# Altium schematic sheet Inclinometer.SchDoc
size 420 x 297 mm; Address1: Address1; Address2: Address2; Address3: Address3; Address4: Address4; DocumentNumber: АБВГ.123456.001 Э3; SheetNumber: 1; Scale: 1:1; DocumentType: Схема электрическая принципиальная; FirstReferrence: АБВГ.123456.001
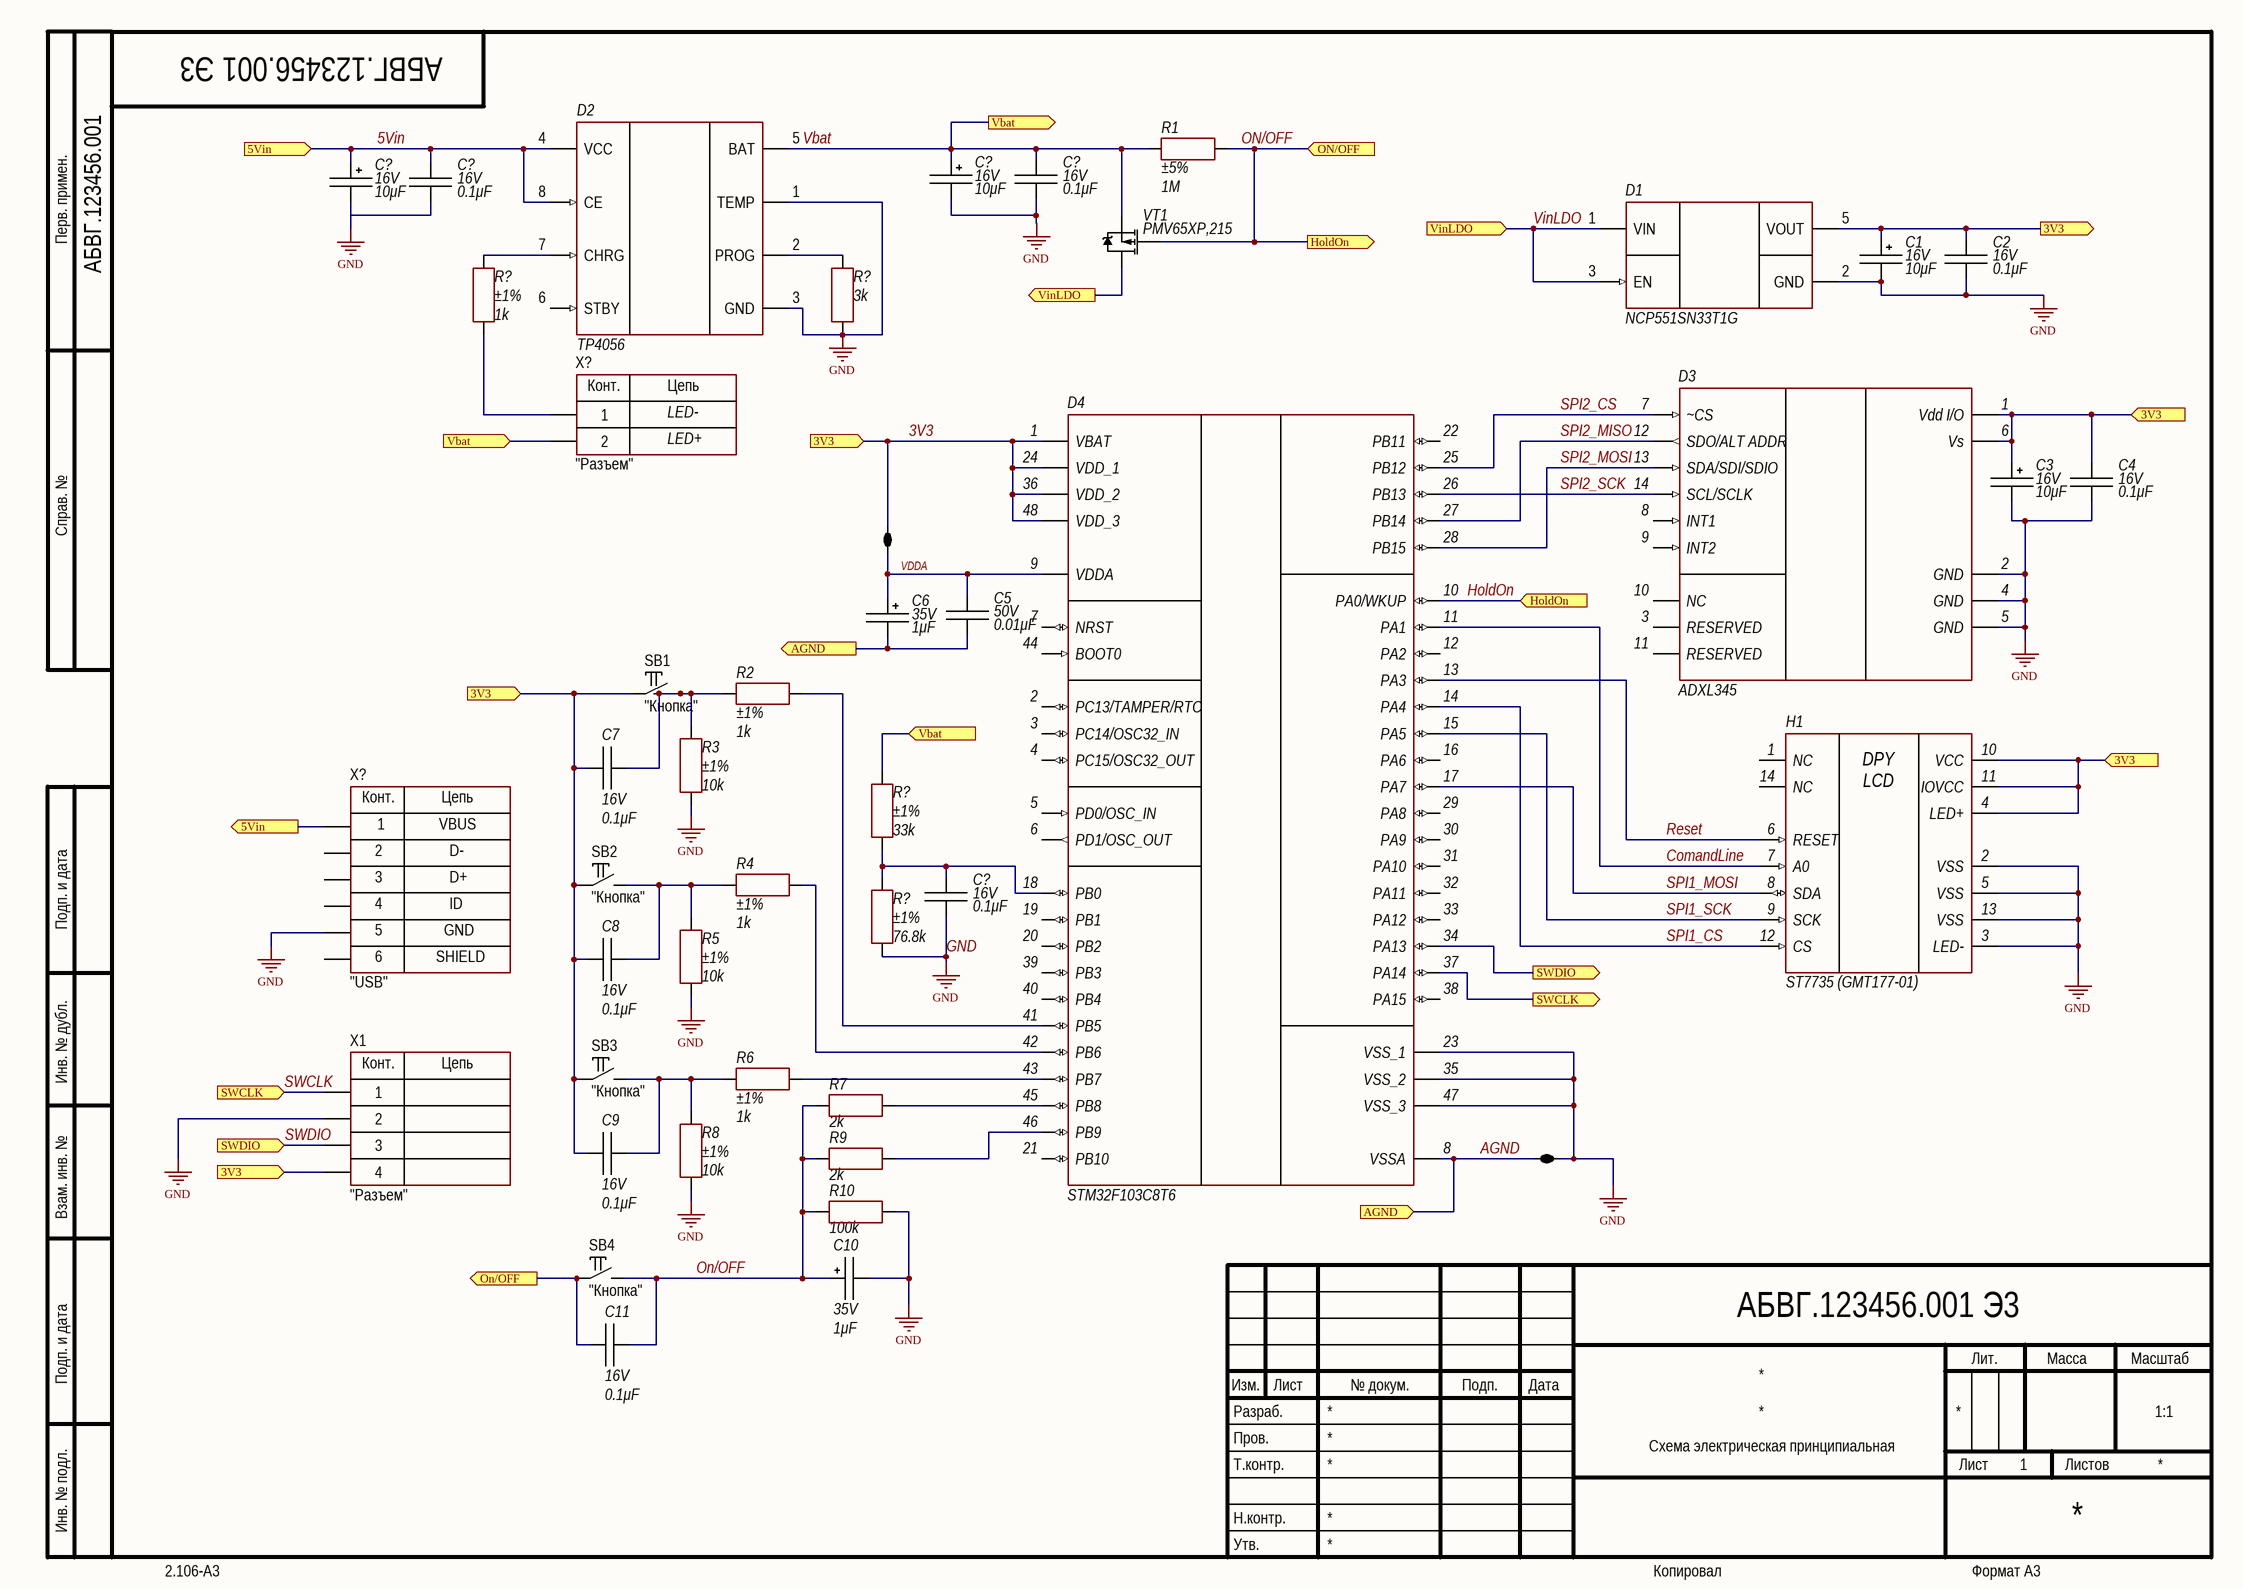
[diagram p0: Inclinometer.SchDoc]

## Parts
(Parts that share a designator on the sheet are numbered #1, #2 ... from top to bottom, then left to right.)
C1  value 10μF  Voltage: 16V  [CAP: TANTAL-A]
C2  value 0.1μF  Voltage: 16V  [CAP: 0603]
C3  value 10μF  Voltage: 16V  [CAP: 0603]  (hidden comment: Ceramic capacitor, 0.1μF, X7R, ±10%, 16V, 0603, -55...+125°C)
C4  value 0.1μF  Voltage: 16V  [CAP: 0603]
C5  value 0.01μF  Voltage: 50V  [CAP: 0603]
C6  value 1μF  Voltage: 35V  [CAP: TANTAL-A]
C7  value 0.1μF  Voltage: 16V  [CAP: 0603]
C8  value 0.1μF  Voltage: 16V  [CAP: 0603]
C9  value 0.1μF  Voltage: 16V  [CAP: 0603]
C10  value 1μF  Voltage: 35V  [CAP: TANTAL-A]
C11  value 0.1μF  Voltage: 16V  [CAP: 0603]
C?#1  value 10μF  Voltage: 16V  [CAP: TANTAL-A]
C?#2  value 0.1μF  Voltage: 16V  [CAP: 0603]
C?#3  value 10μF  Voltage: 16V  [CAP: TANTAL-A]
C?#4  value 0.1μF  Voltage: 16V  [CAP: 0603]
C?#5  value 0.1μF  Voltage: 16V  [CAP: 0603]
D1  (no value)  [5-TSOP]
D2  (no value)  [SOP8]
D3  ADXL345  [ADXL345]
D4  STM32F103C8T6  [LQFP48]
H1  ST7735 (GMT177-01)  [ST7735 DISPLAY]
J1  2 way net tie junction  [2way_MP]  (value not drawn)  (net tie, no BOM)
J2  2 way net tie junction  [2way_MP]  (value not drawn)  (net tie, no BOM)
R1  value 1M  Tolerance: ±5%  [RES: 0603]
R2  value 1k  Tolerance: ±1%  [RES: 0603]
R3  value 10k  Tolerance: ±1%  [RES: 0603]
R4  value 1k  Tolerance: ±1%  [RES: 0603]
R5  value 10k  Tolerance: ±1%  [RES: 0603]
R6  value 1k  Tolerance: ±1%  [RES: 0603]
R7  value 2k  [RES: 0603]
R8  value 10k  Tolerance: ±1%  [RES: 0603]
R9  value 2k  [RES: 0603]
R10  value 100k  [RES: 0603]
R?#1  value 1k  Tolerance: ±1%  [RES: 0603]
R?#2  value 3k  [RES: 0603]
R?#3  value 33k  Tolerance: ±1%  [RES: 0603]
R?#4  value 76.8k  Tolerance: ±1%  [RES: 0603]
SB1  CommentText: "Кнопка"  [BUT: 6x6]
SB2  CommentText: "Кнопка"  [BUT: 6x6]
SB3  CommentText: "Кнопка"  [BUT: 6x6]
SB4  CommentText: "Кнопка"  [BUT: 6x6]
VT1  PartNumber: PMV65XP,215  [SOT23]
X1  CommentText: "Разъем"  [CON: PLS-4]
X?#1  CommentText: "Разъем"  [CON: PLS-2]
X?#2  CommentText: "USB"  [CON: USB micro-A (ZX62-B-5PA)]

## Ports
3V3 (in), 3V3 (out), 5Vin (in), 5Vin (out), AGND (in), AGND (out), HoldOn (in), HoldOn (out), ON/OFF (in), On/OFF (out), SWCLK (in), SWCLK (out), SWDIO (in), SWDIO (out), Vbat (in), Vbat (out), VinLDO (in), VinLDO (out)

## Nets
GND: C1.2 C2.1 C3.2 C4.1 C10.2 C?#1.2 C?#2.1 C?#3.2 C?#4.1 C?#5.1 D1.2(GND) D2.1(TEMP) D2.3(GND) D3.2(GND) D3.4(GND) D3.5(GND) D4.23(VSS_1) D4.35(VSS_2) D4.47(VSS_3) H1.2(VSS) H1.3(LED-) H1.5(VSS) H1.13(VSS) J2.2 R3.1 R5.1 R8.1 R10.2 R?#2.1 R?#4.1 X1.2 X?#2.5
3V3: C1.1 C2.2 C3.2 C4.2 C7.1 C8.1 C9.1 D1.5(VOUT) D3.1(Vdd_I/O) D3.6(Vs) D4.1(VBAT) D4.24(VDD_1) D4.36(VDD_2) D4.48(VDD_3) H1.4(LED+) H1.10(VCC) H1.11(IOVCC) J1.1 SB1.1 SB2.1 SB3.1 X1.4 ; port 3V3
5Vin: C?#1.1 C?#2.2 D2.4(VCC) D2.8(CE) X?#2.1 ; port 5Vin
AGND: C5.1 C6.2 D4.8(VSSA) J2.1 ; port AGND
ComandLine: D4.11(PA1) H1.7(A0)
HoldOn: C10.1 C11.1 C11.2 D4.10(PA0/WKUP) R1.2 R7.1 R9.1 R10.1 SB4.1 SB4.2 VT1.1(G) ; port ON/OFF, port HoldOn, port On/OFF  [also labelled ON/OFF]
Reset: D4.13(PA3) H1.6(RESET)
SPI1_CS: D4.14(PA4) H1.12(CS)
SPI1_MOSI: D4.17(PA7) H1.8(SDA)
SPI1_SCK: D4.15(PA5) H1.9(SCK)
SPI2_CS: D3.7(~CS) D4.25(PB12)
SPI2_MISO: D3.12(SDO/ALT_ADDR) D4.27(PB14)
SPI2_MOSI: D3.13(SDA/SDI/SDIO) D4.28(PB15)
SPI2_SCK: D3.14(SCL/SCLK) D4.26(PB13)
SWCLK: D4.37(PA14) X1.1 ; port SWCLK
SWDIO: D4.34(PA13) X1.3 ; port SWDIO
Vbat: C?#3.1 C?#4.2 D2.5(BAT) R1.1 R?#3.2 VT1.2(S) X?#1.2 ; port Vbat
VDDA: C5.2 C6.1 D4.9(VDDA) J1.2
VinLDO: D1.1(VIN) D1.3(EN) VT1.3(D) ; port VinLDO
NetC7_2: C7.2 R2.1 R3.2 SB1.2
NetC8_2: C8.2 R4.1 R5.2 SB2.2
NetC9_2: C9.2 R6.1 R8.2 SB3.2
NetC?#5_2: C?#5.2 D4.18(PB0) R?#3.1 R?#4.2
NetD2_2: D2.2(PROG) R?#2.2
NetD2_7: D2.7(CHRG) R?#1.2
NetD4_41: D4.41(PB5) R2.2
NetD4_42: D4.42(PB6) R4.2
NetD4_43: D4.43(PB7) R6.2
NetD4_45: D4.45(PB8) R7.2
NetD4_46: D4.46(PB9) R9.2
NetR?#1_1: R?#1.1 X?#1.1

Not connected (* = marked no-connect by the designer): D2 6(STBY); D3 3(RESERVED) 8(INT1) 9(INT2) 10(NC) 11(RESERVED); D4 2(PC13/TAMPER/RTC) 3(PC14/OSC32_IN) 4(PC15/OSC32_OUT) 5(PD0/OSC_IN) 6(PD1/OSC_OUT) 7(NRST) 12(PA2) 16(PA6) 19(PB1) 20(PB2) 21(PB10) 22(PB11) 29(PA8) 30(PA9) 31(PA10) 32(PA11) 33(PA12) 38(PA15) 39(PB3) 40(PB4) 44(BOOT0); H1 1(NC) 14(NC); X?#2 0 2 3 4

## Notes on the sheet
- LED-
- LED+
- Перв. примен.
- Справ. №
- Подп. и дата
- Инв. № дубл.
- Взам. инв. №
- Разраб.
- Изм.
- Лист
- № докум.
- Подп.
- Дата
- Лит.
- Масса
- Масштаб
- Пров.
- Т.контр.
- Листов
- Инв. № подл.
- Утв.
- Н.контр.
- 2.106-A3
- Копировал
- Формат А3
- (in symbol Connector_USB_micro_B) Конт.; Цепь; VBUS; D-; D+; ID; GND; 6; SHIELD
- (in symbol PLS-2) Конт.; Цепь
- (in symbol PLS-4) Конт.; Цепь
- (in symbol ST7735 DISPLAY) DPY / LCD

## Library data of the parts
C1 C?#1 C?#3 = Tantal_A: Manufacturer: AVX; PartNumber: TAJA106K016RNJ; ValueManufacturerPartNumber: Tantalum capacitor, 10μF, 16V, ±10%, 3Ohm, case A (3216), -55...+125°C; Impedance: 3Ohm; Tolerance: ±10%; TypeCapacitor: Tantalum capacitor; Package: case A (3216); HelpURL: https://www.digikey.com/product-detail/en/avx-corporation/TAJA106K016RNJ/478-1655-1-ND/564687; Temperature: -55...+125°C
C2 C4 C7-C9 C11 C?#2 C?#4 C?#5 = Ceramic_0603: Manufacturer: Murata Electronics; PartNumber: GRM188R71C104KA01D; ValueManufacturerPartNumber: Ceramic capacitor, 0.1μF, X7R, ±10%, 16V, 0603, -55...+125°C; TypeCapacitor: Ceramic capacitor; Tolerance: ±10%; TypeDielectric: X7R; Package: 0603; HelpURL: https://www.digikey.com/product-detail/en/murata-electronics/GRM188R71C104KA01D/490-1532-2-ND/587060; Temperature: -55...+125°C
C3 = Tantal_A: Manufacturer: AVX; PartNumber: TAJA106K016RNJ; ValueManufacturerPartNumber: Tantalum capacitor, 10μF, 16V, ±10%, 3Ohm, case A (3216), -55...+125°C; Impedance: 3Ohm; TypeCapacitor: Tantalum capacitor; Package: case A (3216); HelpURL: https://www.digikey.com/product-detail/en/avx-corporation/TAJA106K016RNJ/478-1655-1-ND/564687; Temperature: -55...+125°C; Tolerance: ±10%
C5 = Ceramic_0603: Manufacturer: Murata Electronics; PartNumber: GRM188R71H103KA01D; ValueManufacturerPartNumber: Ceramic capacitor, 0.01μF, X7R, ±10%, 50V, 0603, -55...+125°C; TypeCapacitor: Ceramic capacitor; Tolerance: ±10%; TypeDielectric: X7R; Package: 0603; HelpURL: https://www.digikey.com/product-detail/en/murata-electronics/GRM188R71H103KA01D/490-1512-2-ND/587151; Temperature: -55...+125°C
C6 C10 = Tantal_A: Manufacturer: AVX; PartNumber: TAJA105K035RNJ; ValueManufacturerPartNumber: Tantalum capacitor, 1μF, 35V, ±10%, 7.5Ohm, case A (3216), -55...+125°C; Impedance: 7.5Ohm; Tolerance: ±10%; TypeCapacitor: Tantalum capacitor; Package: case A (3216); HelpURL: https://www.digikey.com/product-detail/en/avx-corporation/TAJA105K035RNJ/478-1651-2-ND/563759; Temperature: -55...+125°C
D1 = NCP551SN33T1G: Linear voltage regulator; Manufacturer: ON Semiconductor; ValueManufacturerPartNumber: Linear voltage regulator, input 0...12V, 0.25V, output 3.3V, 150mA, -40...+85°C, TSOP-5; CurrentOutput: 150mA; MaxDropout: 0.25V; VoltageInput: input 0...12V; VoltageOutput: output 3.3V; ComponentType: Linear voltage regulator; HelpURL: https://www.digikey.com/en/products/detail/onsemi/NCP551SN33T1G/13511773; Package: TSOP-5; Temperature: -40...+85°C; PartNumber: NCP551SN33T1G
D2 = TP4056: Linear Li-lon Battery Charger; Manufacturer: Top Power; CurrentOutput: 1A; ComponentType: Linear Li-lon Battery Charger; HelpURL: https://www.chipdip.ru/product/tp4056; Package: SOP-8; Temperature: -40...+85°C; ValueManufacturerPartNumber: =ComponentType+', '+VoltageInput+', '+MaxDropout+', '+VoltageOutput+', '+CurrentOutput+', '+Temperature+', '+Package; PartNumber: TP4056
D3 = ADXL345: Axlerometer sensor; Manufacture: Analog Device; Help URL: https://www.analog.com/media/en/technical-documentation/data-sheets/ADXL345.pdf; Case: СС-14-1; Model: ADXL345
D4 = STM32F103C8T6: 32bit microcontroller; Manufacture: ST; Case: LQFP48 (7x7mm); Model: STM32F103C8T6
H1 = ST7735 DISPLAY: Manufacture: Sitronix; Model: ST7735 (GMT177-01); Help URL: https://pdf1.alldatasheetru.com/datasheet-pdf/view/326213/SITRONIX/ST7735.html
J1 J2 = 2way: ComponentLink1URL: http://www.edatools.cz/addons; ComponentLink1Description: Source; FootprintNote: LP=12mil, MP=40mil, HP=120mil
R1 = Resistor_0603: Manufacturer: Yageo; PartNumber: RC0603JR-071ML; ValueManufacturerPartNumber: Resistor film, 1M, ±5%, 0603, 0.1W, -55...+155°C; TypeResistor: Resistor film; Power: 0.1W; Package: 0603; HelpURL: https://www.digikey.com/product-detail/en/yageo/RC0603FR-071KL/311-1-00KHRCT-ND/729790; Temperature: -55...+155°C
R2 R4 R6 R?#1 = Resistor_0603: Manufacturer: Yageo; PartNumber: RC0603FR-071KL; ValueManufacturerPartNumber: Resistor film, 1k, ±1%, 0603, 0.1W, -55...+155°C; TypeResistor: Resistor film; Power: 0.1W; Package: 0603; HelpURL: https://www.digikey.com/product-detail/en/yageo/RC0603FR-071KL/311-1-00KHRCT-ND/729790; Temperature: -55...+155°C
R3 R5 R8 = Resistor_0603: Manufacturer: Yageo; PartNumber: RC0603FR-0710KL; ValueManufacturerPartNumber: Resistor film, 10k, ±1%, 0603, 0.1W, -55...+155°C; TypeResistor: Resistor film; Power: 0.1W; Package: 0603; HelpURL: https://www.digikey.com/product-detail/en/yageo/RC0603FR-0710KL/311-10-0KHRCT-ND/729827; Temperature: -55...+155°C
R7 R9 = Resistor_0603: Manufacturer: Yageo; PartNumber: RC0603FR-072KL; ValueManufacturerPartNumber: Resistor film, 2k, ±1%, 0603, 0.1W, -55...+155°C; TypeResistor: Resistor film; Power: 0.1W; Tolerance: ±1%; Package: 0603; HelpURL: https://www.digikey.com/product-detail/en/yageo/RC0603FR-071KL/311-1-00KHRCT-ND/729790; Temperature: -55...+155°C
R10 = Resistor_0603: Manufacturer: Yageo; PartNumber: RC0603JR-07100KL; ValueManufacturerPartNumber: Resistor film, 100k, ±5%, 0603, 0.1W, -55...+155°C; TypeResistor: Resistor film; Power: 0.1W; Tolerance: ±5%; Package: 0603; HelpURL: https://www.digikey.com/product-detail/en/yageo/RC0603FR-071KL/311-1-00KHRCT-ND/729790; Temperature: -55...+155°C
R?#2 = Resistor_0603: Manufacturer: Yageo; PartNumber: RC0603FR-073KL; ValueManufacturerPartNumber: Resistor film, 3k, ±1%, 0603, 0.1W, -55...+155°C; TypeResistor: Resistor film; Power: 0.1W; Tolerance: ±1%; Package: 0603; HelpURL: https://www.digikey.com/product-detail/en/yageo/RC0603FR-071KL/311-1-00KHRCT-ND/729790; Temperature: -55...+155°C
R?#3 = Resistor_0603: Manufacturer: Yageo; PartNumber: RC0603JR-0733KL; ValueManufacturerPartNumber: Resistor film, 33k, ±1%, 0603, 0.1W, -55...+155°C; TypeResistor: Resistor film; Power: 0.1W; Package: 0603; HelpURL: https://www.digikey.com/product-detail/en/yageo/RC0603FR-0720KL/311-20-0KHRCT-ND/729987; Temperature: -55...+155°C
R?#4 = Resistor_0603: Manufacturer: Yageo; PartNumber: RC0603FR-0776K8L; ValueManufacturerPartNumber: Resistor film, 76.8k, ±1%, 0603, 0.1W, -55...+155°C; TypeResistor: Resistor film; Power: 0.1W; Package: 0603; HelpURL: https://www.digikey.com/product-detail/en/yageo/RC0603FR-0710KL/311-10-0KHRCT-ND/729827; Temperature: -55...+155°C
SB1-SB4 = Button_tactile: Manufacturer: TE Connectivity; ValueManufacturerPartNumber: Tactile button, 6x6mm; PartNumber: FSM2JSMAATR; TypeButton: Tactile button; HelpURL: https://www.digikey.com/product-detail/en/te-connectivity-alcoswitch-switches/FSM2JSMAATR/450-1792-1-ND/3503931; Package: 6x6mm
VT1 = MOSFET_P_PMV65XP: Manufacturer: Nexperia; ValueManufacturerPartNumber: MOSFET P-channel transistor, -20V, -2.8A, 7.7nC, 4.16W, 58mOhm, 744pF, SOT23, -55...+150°C; CurrentDS: -2.8A; GateCharge: 7.7nC; InputCapacitor: 744pF; MaxPower: 4.16W; RDS: 58mOhm; TypeTransistor: MOSFET P-channel transistor; VoltageDS: -20V; HelpURL: https://www.digikey.com/en/products/detail/nexperia-usa-inc/PMV65XP215/949643; Package: SOT23; Temperature: -55...+150°C
X1 = PLS-4: Manufacturer: Connfly; ValueManufacturerPartNumber: Connector, 4pin, 2.54mm, 500VAC, 3A; TypeConnector: Connector; VoltageMax: 500VAC; Pitch: 2.54mm; CurrentMax: 3A; Multichannel: 4pin; HelpURL: https://www.chipdip.ru/product/pls-4; PartNumber: PLS-4
X?#1 = PLS-2: Manufacturer: Connfly; ValueManufacturerPartNumber: Connector, 2pin, 2.54mm, 500VAC, 3A; TypeConnector: Connector; VoltageMax: 500VAC; Pitch: 2.54mm; CurrentMax: 3A; Multichannel: 2pin; HelpURL: https://www.chipdip.ru/product/pls-2; PartNumber: PLS-2
X?#2 = Connector_USB_micro_B: Manufacturer: Hirose Electric; ValueManufacturerPartNumber: USB micro B; PartNumber: ZX62-B-5PA; HelpURL: https://www.digikey.com/product-detail/en/hirose-electric-co-ltd/ZX62-B-5PA/H11579CT-ND/1851090; TypeConnector: USB micro B